# EAGLE design ltc (EAGLE 4.13)
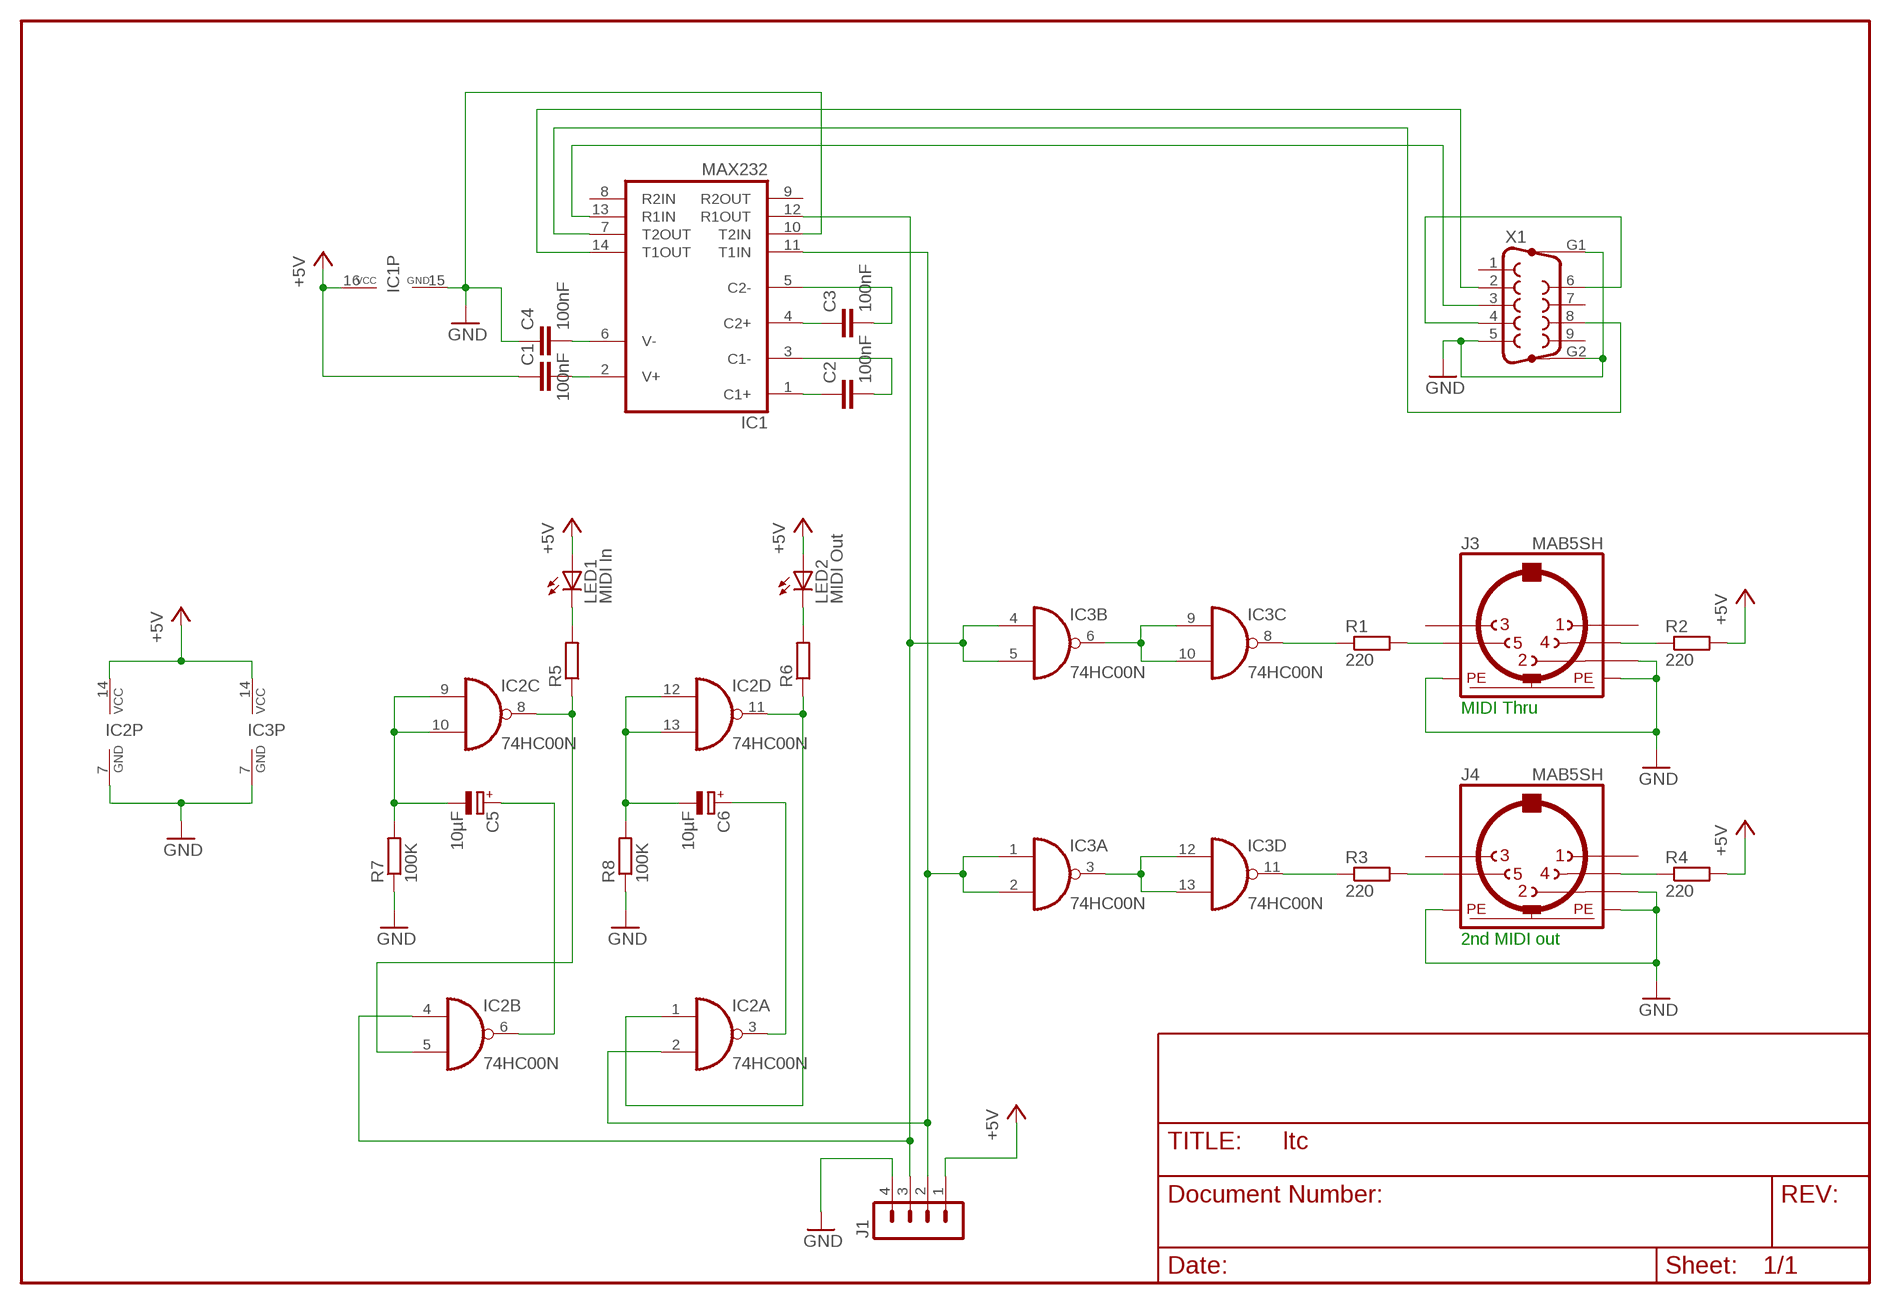
[diagram p0: schematic, sheet 1]

## Parts
C1  100nF  C-EU050-025X075  [C050-025X075]
C2  100nF  C-EU050-025X075  [C050-025X075]
C3  100nF  C-EU050-025X075  [C050-025X075]
C4  100nF  C-EU050-025X075  [C050-025X075]
C5  10µF  CPOL-EUE2.5-5  [E2,5-5]
C6  10µF  CPOL-EUE2.5-5  [E2,5-5]
IC1  MAX232  [DIL16]
IC2  74HC00N  [DIL14]
IC3  74HC00N  [DIL14]
J1  MA04-1  [MA04-1]
J3  MAB5SH  [MAB5SH]
J4  MAB5SH  [MAB5SH]
LED1  MIDI In  LED3MM  [LED3MM]
LED2  MIDI Out  LED3MM  [LED3MM]
R1  220  R-EU_0207/7  [0207/7]
R2  220  R-EU_0207/7  [0207/7]
R3  220  R-EU_0207/7  [0207/7]
R4  220  R-EU_0207/7  [0207/7]
R5  R-EU_0207/2V  [0207/2V]
R6  R-EU_0207/2V  [0207/2V]
R7  100K  R-EU_0207/7  [0207/7]
R8  100K  R-EU_0207/7  [0207/7]
X1  F09HP  [F09HP]

## Nets
+5V: C1.1 IC1.16(VCC) IC2.14(P:VCC) IC3.14(P:VCC) J1.1 LED1.A LED2.A R2.2 R4.2
GND: C4.1 IC1.10(T2IN) IC1.15(GND) IC2.7(P:GND) IC3.7(P:GND) J1.4 J3.2 J3.PE J3.PE@(PE) J4.2 J4.PE J4.PE@(PE) R7.1 R8.1 X1.5 X1.G1 X1.G2
N$1: IC3.11(D:O) R3.1
N$2: J3.5 R1.2
N$3: J3.4 R2.1
N$4: J4.5 R3.2
N$5: J4.4 R4.1
N$6: IC1.13(R1IN) X1.3
N$7: IC2.5(B:I1) IC2.8(C:O) R5.1
N$8: IC2.1(A:I0) IC2.11(D:O) R6.1
N$9: C5.- IC2.9(C:I0) IC2.10(C:I1) R7.2
N$10: IC3.8(C:O) R1.1
N$12: IC3.6(B:O) IC3.9(C:I0) IC3.10(C:I1)
N$13: IC3.3(A:O) IC3.12(D:I0) IC3.13(D:I1)
N$14: IC1.12(R1OUT) IC2.4(B:I0) IC3.4(B:I0) IC3.5(B:I1) J1.3
N$15: IC1.11(T1IN) IC2.2(A:I1) IC3.1(A:I0) IC3.2(A:I1) J1.2
N$16: C6.- IC2.12(D:I0) IC2.13(D:I1) R8.2
N$17: C5.+ IC2.6(B:O)
N$18: C6.+ IC2.3(A:O)
N$19: LED1.K(C) R5.2
N$20: LED2.K(C) R6.2
N$21: C2.1 IC1.1(C1+)
N$22: C2.2 IC1.3(C1-)
N$23: C3.1 IC1.4(C2+)
N$24: C3.2 IC1.5(C2-)
N$25: C4.2 IC1.6(V-)
N$26: C1.2 IC1.2(V+)
N$29: IC1.14(T1OUT) X1.2
N$30: IC1.7(T2OUT) X1.8
N$31: X1.4 X1.6
Unconnected: IC1.8(R2IN) IC1.9(R2OUT) J3.1 J3.3 J4.1 J4.3 X1.1 X1.7 X1.9

## Notes on the sheet
- MIDI Thru
- 2nd MIDI out

## Library data of the parts
C1-C4 = rcl:C-EU: CAPACITOR, European symbol
C5 C6 = rcl:CPOL-EU: POLARIZED CAPACITOR, European symbol
IC1 = maxim:MAX232: RS232 TRANSEIVER
IC2 IC3 = 74xx-eu:74*00: Quad 2-input NAND gate
J1 = con-lstb:MA04-1: PIN HEADER
J3 J4 = con-hirschmann:MAB5SH: Female CONNECTOR 5 pins 90 deg. with shield, horizontal (DIN 41524)
LED1 LED2 = led:LED: LED OSRAM: - CHIPLED LG R971, LG N971, LY N971, LG Q971, LY Q971, LO R971, LY R971 LH N974, LH R974 LS Q976, LO Q976, LY Q976 LO Q996 - Hyper CHIPLED LW Q18S LB Q993, LB Q99A, LB R99A - SideLED LS A670, LO A670, LY A670, LG A670, LP A670 LB A673, LV A673, LT A673, LW A673 LH A674 LY A675 LS A676, LA A676, LO A676, LY A676, LW A676 LS A679, LY A679, LG A679 - Hyper Micro SIDELED® LS Y876, LA Y876, LO Y876, LY Y876 LT Y87S - SmartLED LW L88C, LW L88S LB L89C, LB L89S, LG L890 LS L89K, LO L89K, LY L89K LS L896, LA L896, LO L896, LY L896 - TOPLED LS T670, LO T670, LY T670, LG T670, LP T670 LSG T670, LSP T670, LSY T670, LOP T670, LYG T670 LG T671, LOG T671, LSG T671 LB T673, LV T673, LT T673, LW T673 LH T674 LS T676, LA T676, LO T676, LY T676, LB T676, LH T676, LSB T676, LW T676 LB T67C, LV T67C, LT T67C, LS T67K, LO T67K, LY T67K, LW E67C LS E67B, LA E67B, LO E67B, LY E67B, LB E67C, LV E67C, LT E67C LW T67C LS T679, LY T679, LG T679 LS T770, LO T770, LY T770, LG T770, LP T770 LB T773, LV T773, LT T773, LW T773 LH T774 LS E675, LA E675, LY E675, LS T675 LS T776, LA T776, LO T776, LY T776, LB T776 LHGB T686 LT T68C, LB T68C - Hyper Mini TOPLED® LB M676 - Mini TOPLED Santana® LG M470 LS M47K, LO M47K, LY M47K Source: http://www.osram.convergy.de/
R1-R8 = rcl:R-EU_: RESISTOR, European symbol
X1 = con-subd:F09HP: SUB-D

## Board
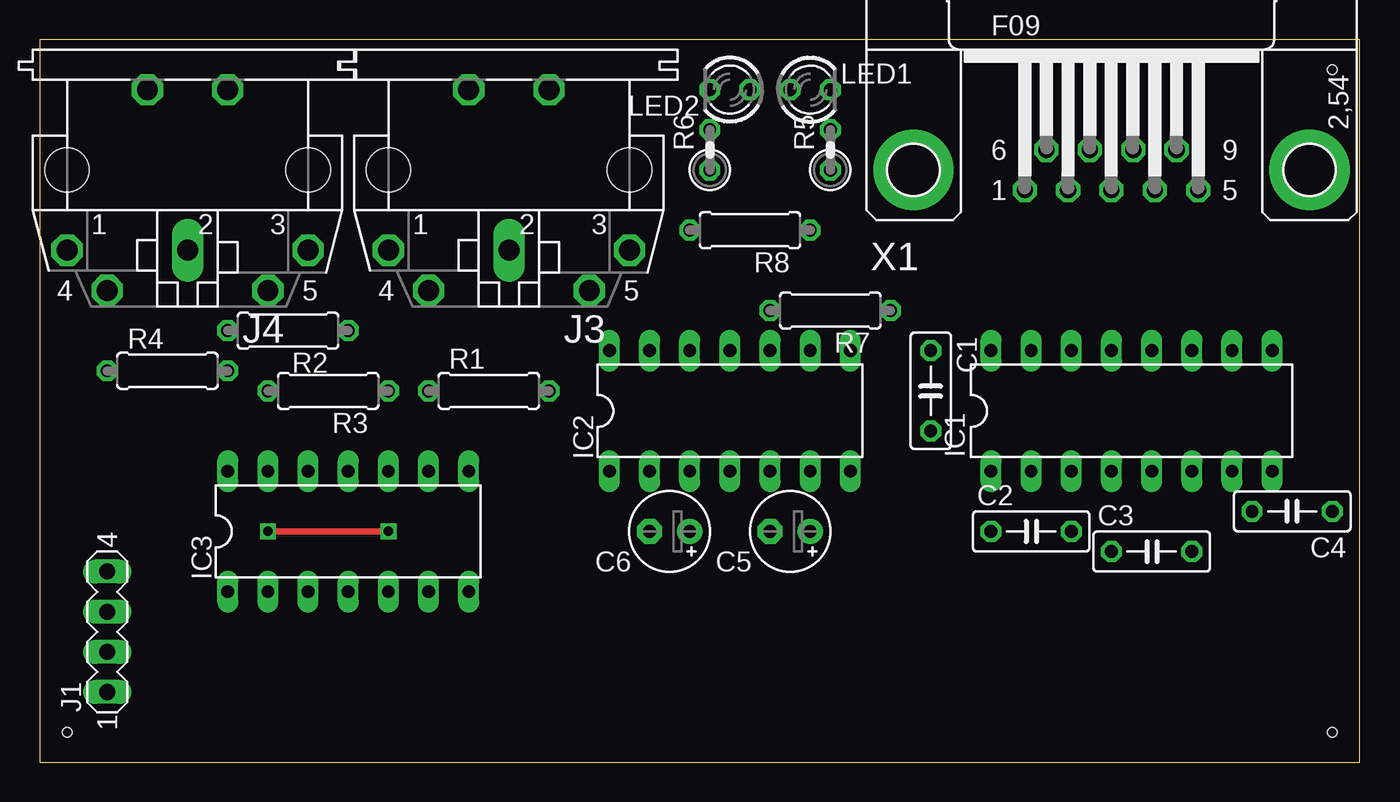
[diagram p1: board, top side]
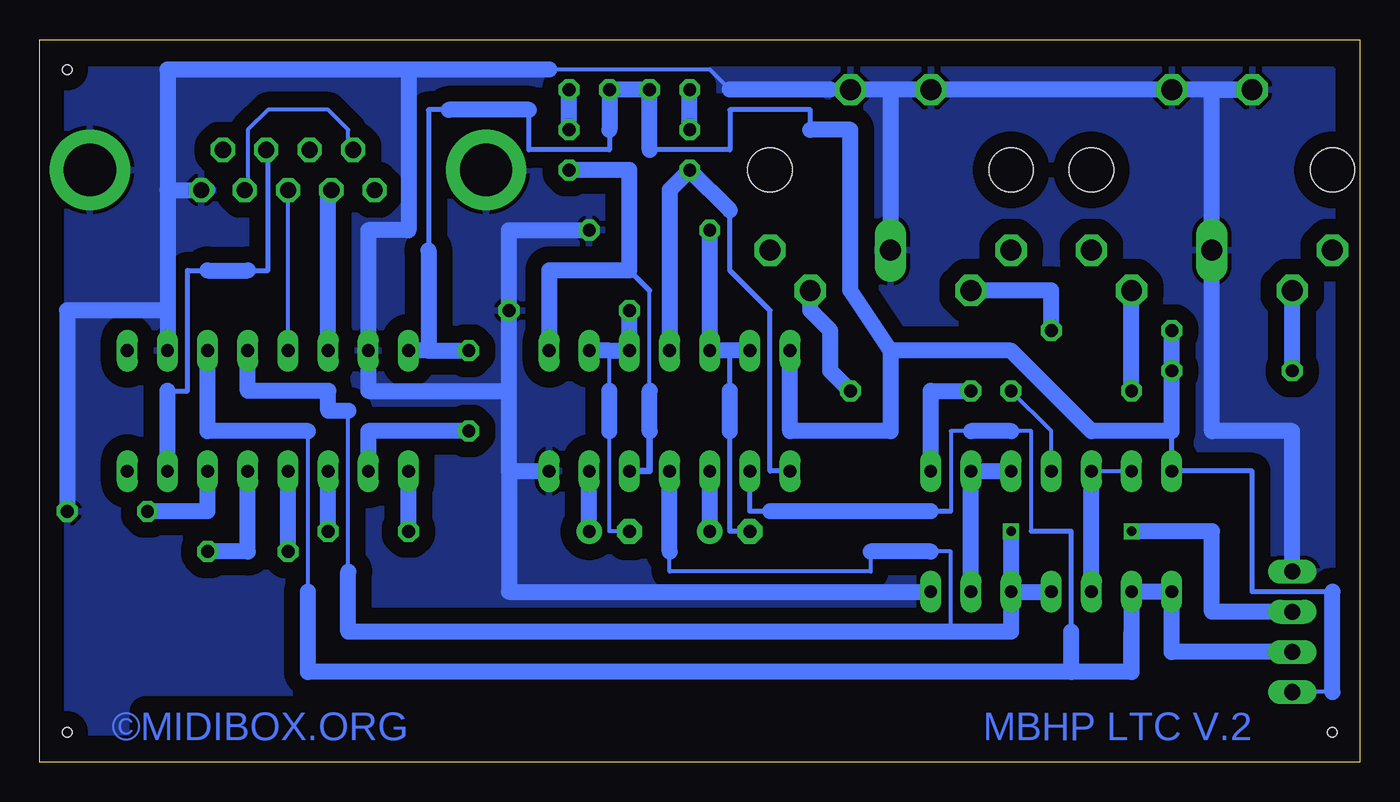
[diagram p2: board, bottom side, seen from below]

Size 83.49 x 45.71 mm. Coordinates in mm from the lower left corner, seen from the top.
Outline: 83.49,45.71 0,45.71 0,0 83.49,0 83.49,45.71
Copper layers (1*16): Top 0.035mm / dielectric 1.5mm / Bottom 0.035mm
Design rules "default": minimum track width 10mil, minimum drill 24mil, track to track 8mil, track to pad 8mil, pad to pad 8mil, via to via 8mil, smd to smd 8mil, copper to edge 40mil, drill to drill 8mil, minimum pad ring 10mil, minimum via ring 8mil, stop-mask expansion 4mil, vias tented up to drill 0mil, thermal gap 10mil
Holes 0.6 mm at 81.75,43.81 81.75,1.9 1.74,1.9

### Footprints (pad centres in the part's own frame; a part is rotated, then mirrored left to right if it is on the bottom)
C050-025X075 = drill 0.813 octagon: 1 -2.54,0; 2 2.54,0
E2,5-5 = drill 0.813 pad 1.6 round: + -1.27,0 | drill 0.813 pad 1.6 octagon: - 1.27,0
DIL16 = drill 0.813 long: 1 -8.89,-3.81; 2 -6.35,-3.81; 3 -3.81,-3.81; 4 -1.27,-3.81; 5 1.27,-3.81; 6 3.81,-3.81; 7 6.35,-3.81; 8 8.89,-3.81; 9 8.89,3.81; 10 6.35,3.81; 11 3.81,3.81; 12 1.27,3.81; 13 -1.27,3.81; 14 -3.81,3.81; 15 -6.35,3.81; 16 -8.89,3.81
DIL14 = drill 0.813 long: 1 -7.62,-3.81; 2 -5.08,-3.81; 3 -2.54,-3.81; 4 0,-3.81; 5 2.54,-3.81; 6 5.08,-3.81; 7 7.62,-3.81; 8 7.62,3.81; 9 5.08,3.81; 10 2.54,3.81; 11 0,3.81; 12 -2.54,3.81; 13 -5.08,3.81; 14 -7.62,3.81
MA04-1 = drill 1.016 long: 1 -3.81,0; 2 -1.27,0; 3 1.27,0; 4 3.81,0
MAB5SH = drill 1.321 octagon: 1 7.62,5.08; 3 -7.62,5.08; 4 5.08,7.62; 5 -5.08,7.62; PE -2.54,-5.08; PE@ 2.54,-5.08 | drill 1.321 long: 2 0,5.08 | hole 2.794: 7.62,0; -7.62,0
LED3MM = drill 0.813 octagon: A -1.27,0; K 1.27,0
0207/7 = drill 0.813 octagon: 1 -3.81,0; 2 3.81,0
0207/2V = drill 0.813 octagon: 1 -1.27,0; 2 1.27,0
F09HP = drill 1.016 octagon: 1 -5.486,-1.27; 2 -2.743,-1.27; 3 0,-1.27; 4 2.743,-1.27; 5 5.486,-1.27; 6 -4.115,1.27; 7 -1.372,1.27; 8 1.372,1.27; 9 4.115,1.27 | drill 3.302 pad 5.08 round: G1 -12.522,0; G2 12.522,0

### Placement (x,y rotation side)
C1  56.35,23.49 270 top
C2  62.7,14.6 0 top
C3  70.32,13.33 0 top
C4  79.21,15.87 180 top
C5  47.46,14.6 180 top
C6  39.84,14.6 180 top
IC1  69.05,22.22 0 top
IC2  43.65,22.22 0 top
IC3  19.52,14.6 0 top
J1  4.28,8.25 90 top
J3  29.68,37.46 180 top
J4  9.36,37.46 180 top
LED1  48.73,42.54 0 top
LED2  43.65,42.54 180 top
R1  28.41,23.49 0 top
R2  15.71,27.3 180 top
R3  18.25,23.49 180 top
R4  8.09,24.76 0 top
R5  50,38.73 90 top
R6  42.38,38.73 90 top
R7  50,28.57 180 top
R8  44.92,33.65 180 top
X1  67.78,37.46 0 top

### Tracks (layer width: path | path; a pad name or v marks a point on that pad's centre or on a via)
+5V
  Bottom 0.254: LED2.A LED1.A | R4.2 R2.2 | 1.74,4.44 J1.1 | 44.92,38.73 41.11,38.73
  Bottom 0.305: 44.92,38.73 39.84,38.73 39.84,41.27 34.76,41.27 34.76,40 | LED2.A LED1.A | 47.46,40 47.46,38.73 52.54,38.73 52.54,41.27 | 57.62,41.27 58.89,41.27 58.89,32.38 | 1.74,10.79 6.82,10.79 6.82,18.41 IC3.14 11.9,20.95
  Bottom 1.016: R2.2 R4.2 11.9,20.95 16.98,20.95 22.06,26.03 29.68,26.03 | 1.74,4.44 1.74,10.79 | 29.68,26.03 29.68,20.95 36.03,20.95 IC2.14 | 29.68,26.03 32.22,29.84 32.22,40 34.76,40 | 58.89,26.03 IC1.16 | 58.89,26.03 C1.1 | 58.89,32.38 58.89,26.03 | 52.54,41.27 57.62,41.27 | 44.92,38.73 LED2.A LED1.A 47.46,40
GND
  Bottom 0.254: J4.PE@ J4.PE J3.PE@ | 53.81,23.49 53.81,18.41 | J3.PE 33.49,42.54 | 39.84,42.54 41.11,43.81 51.27,43.81
  Bottom 0.305: 53.81,23.49 R7.1 | IC1.15 62.7,24.76
  Bottom 1.016: C4.1 81.75,28.57 75.4,28.57 | 75.4,28.57 IC1.10 | 75.4,36.19 75.4,28.57 | 75.4,36.19 72.86,36.19 | 75.4,36.19 75.4,43.81 60.16,43.81 | 51.27,43.81 60.16,43.81 | 29.68,42.54 J3.PE | 29.68,42.54 J3.PE@ J4.PE J4.PE@ 9.36,42.54 J4.2 9.36,20.95 4.28,20.95 J1.4 | 29.68,42.54 J3.2 | IC1.15 62.7,33.65 60.16,33.65 60.16,43.81 | 33.49,42.54 39.84,42.54 | R8.1 53.81,33.65 R7.1 53.81,18.41 | 53.81,18.41 53.81,10.79 IC3.7 | 53.81,23.49 62.7,23.49 62.7,24.76 | 53.81,18.41 IC2.7
  pour Bottom (isolate 1.016): 81.75,1.9 1.74,1.9 1.74,43.81 81.75,43.81
N$1
  Bottom 0.254: R3.1 19.52,20.95 IC3.11
N$2
  Bottom 1.016: R1.2 33.49,24.76 33.49,27.3 34.76,28.57 J3.5
N$3
  Bottom 1.016: R2.1 19.52,29.84 J3.4
N$4
  Bottom 0.254: R3.2 J4.5
  Bottom 1.016: R3.2 J4.5
N$5
  Bottom 0.254: R4.1 J4.4
  Bottom 1.016: R4.1 J4.4
N$6
  Bottom 0.254: IC1.13 X1.3
N$7
  Bottom 0.254: 44.92,23.49 44.92,29.84 | 44.92,18.41 44.92,19.68
  Bottom 0.305: 44.92,29.84 46.19,31.11
  Bottom 0.406: 44.92,20.95 44.92,18.41 IC2.5
  Bottom 1.016: R5.1 46.19,37.46 46.19,31.11 51.27,31.11 IC2.8 | 44.92,20.95 44.92,23.49
N$8
  Bottom 0.305: 39.84,34.92 39.84,31.11 37.3,28.57 37.3,18.41 IC2.1
  Bottom 1.016: 39.84,34.92 R6.1 43.65,36.19 IC2.11
N$9
  Bottom 0.254: 47.46,23.49 47.46,26.03 | 47.46,20.95 47.46,14.6 C5.-
  Bottom 1.016: 47.46,20.95 47.46,23.49 | IC2.9 47.46,26.03 IC2.10 R7.2
N$10
  Bottom 1.016: R1.1 27.14,23.49 IC3.8
N$12
  Bottom 1.016: IC3.6 IC3.9 IC3.10
N$13
  Bottom 0.254: IC3.12 IC3.13
  Bottom 1.016: IC3.3 IC3.12
N$14  (via drill 0.6)
  Top 0.406: v14.44,14.6 v22.06,14.6
  Bottom 0.254: 63.97,12.06 63.97,22.22 | 25.87,8.25 56.35,8.25 | 22.06,8.25 25.87,8.25 | 30.95,13.33 30.95,12.06 43.65,12.06 43.65,13.33 | 27.14,13.33 25.87,13.33 25.87,8.25
  Bottom 0.305: 9.36,14.6 13.17,14.6
  Bottom 0.406: 13.17,14.6 v14.44,14.6
  Bottom 1.016: v14.44,14.6 9.36,14.6 9.36,9.52 J1.3 | IC1.12 70.32,23.49 65.24,23.49 65.24,22.22 63.97,22.22 | 63.97,12.06 63.97,8.25 56.35,8.25 22.06,8.25 IC3.5 | 27.14,13.33 30.95,13.33 | 43.65,13.33 IC2.4 | v22.06,14.6 IC3.5 | IC3.5 IC3.4
N$15
  Bottom 0.254: 66.51,10.79 66.51,20.95 | 25.87,15.87 25.87,20.95 24.6,20.95 | 22.06,20.95 20.79,20.95 20.79,14.6
  Bottom 0.305: 20.79,14.6 18.25,14.6 18.25,8.25 | 18.25,5.71 18.25,6.98 | 25.87,15.87 27.14,15.87 | IC2.2 38.57,15.87 37.3,15.87 33.49,15.87
  Bottom 1.016: J1.2 11.9,6.98 IC3.1 IC3.2 14.44,5.71 | 66.51,10.79 66.51,5.71 18.25,5.71 | 14.44,5.71 18.25,5.71 | 18.25,6.98 18.25,8.25 18.25,5.71 | IC1.11 72.86,20.95 66.51,20.95 | 27.14,15.87 32.22,15.87 | 32.22,15.87 33.49,15.87 | 22.06,20.95 24.6,20.95 | 14.44,5.71 14.44,8.25 | 32.22,15.87 37.3,15.87
N$16
  Bottom 0.305: IC2.13 39.84,26.03 39.84,23.49 | 39.84,20.95 39.84,14.6 C6.-
  Bottom 1.016: R8.2 IC2.12 IC2.13 | 39.84,20.95 39.84,23.49
N$17
  Bottom 1.016: C5.+ IC2.6
N$18
  Bottom 1.016: C6.+ IC2.3
N$19
  Bottom 0.254: R5.2 LED1.K
  Bottom 1.016: R5.2 LED1.K
N$20
  Bottom 0.254: R6.2 LED2.K
  Bottom 1.016: R6.2 LED2.K
N$21
  Bottom 0.254: C2.1 IC1.1
  Bottom 1.016: C2.1 IC1.1
N$22
  Bottom 0.254: C2.2 IC1.3
  Bottom 1.016: C2.2 IC1.3
N$23
  Bottom 0.254: C3.1 IC1.4
  Bottom 1.016: C3.1 IC1.4
N$24
  Bottom 1.016: IC1.5 70.32,13.33 C3.2
N$25
  Bottom 0.254: 72.86,15.87 72.86,17.14
  Bottom 1.016: 72.86,17.14 IC1.6 72.86,15.87 C4.2
N$26
  Bottom 1.016: C1.2 62.7,20.95 IC1.2
N$29
  Bottom 0.254: 65.24,36.19 X1.2
  Bottom 1.016: IC1.14 65.24,36.19
N$30
  Bottom 0.254: 69.05,38.73 X1.8
  Bottom 0.305: 75.4,23.49 74.13,23.49 74.13,31.11 72.86,31.11 | 69.05,38.73 69.05,31.11 70.32,31.11
  Bottom 1.016: IC1.7 75.4,23.49 | 72.86,31.11 70.32,31.11
N$31
  Bottom 0.254: X1.4 70.32,36.19 70.32,40 69.05,41.27 65.24,41.27 63.97,40 63.97,38.73 X1.6

### Text on the board
Bottom: MBHP LTC V.2 | ©MIDIBOX.ORG